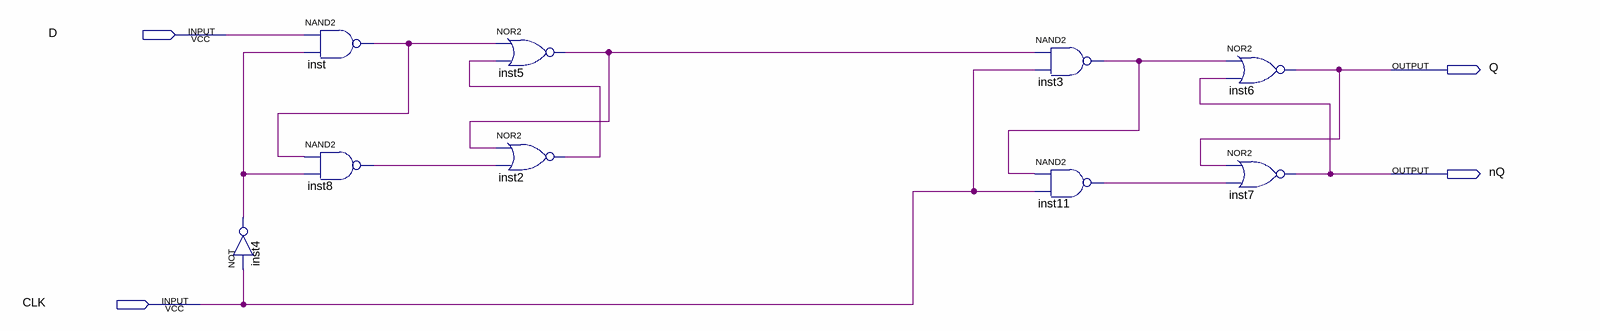
[diagram p0: schematic sheet]
// Quartus schematic Dtr.bdf as structural Verilog: 9 symbols, 4 pins
module Dtr (
  input  D,
  input  CLK,
  output Q,
  output nQ
);

  wire inst2_out, inst3_out, inst4_out, inst5_out, inst8_out, inst11_out, inst_out;

  not inst4 (inst4_out, CLK);
  nand inst (inst_out, D, inst4_out);
  nand inst8 (inst8_out, inst_out, inst4_out);
  nor inst5 (inst5_out, inst_out, inst2_out);
  nor inst2 (inst2_out, inst5_out, inst8_out);
  nand inst3 (inst3_out, inst5_out, CLK);
  nand inst11 (inst11_out, inst3_out, CLK);
  nor inst6 (Q, inst3_out, nQ);
  nor inst7 (nQ, Q, inst11_out);
endmodule
